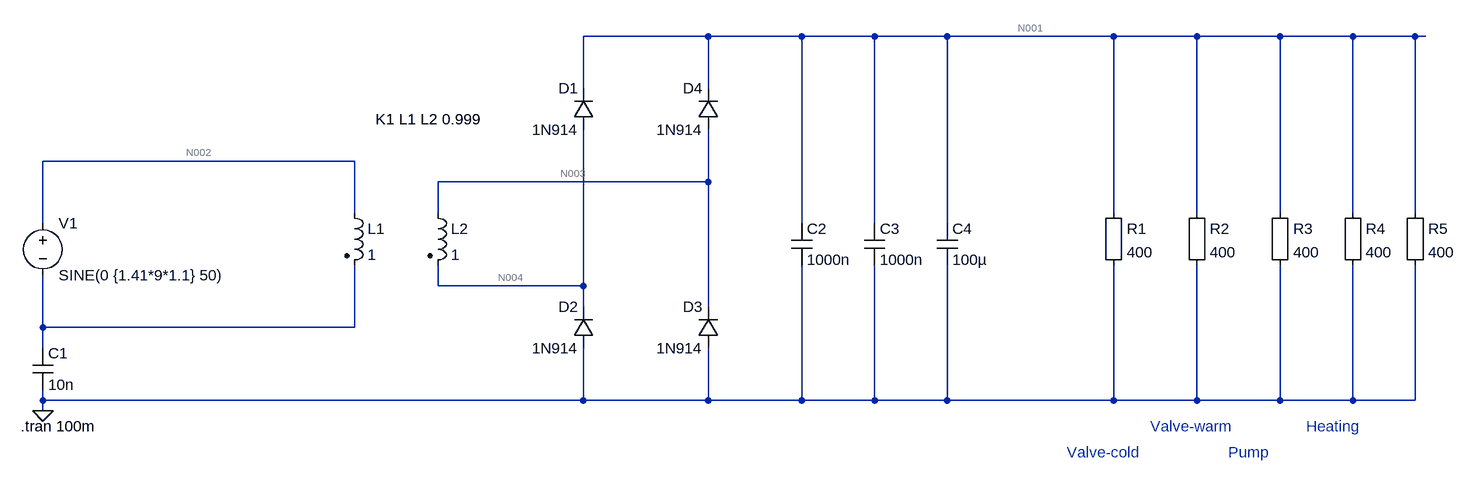
[diagram p0: schematic powersupply.asc]
powersupply.asc, the LTspice schematic file:
Version 4
SHEET 1 2320 680
WIRE 1168 -144 976 -144
WIRE 1312 -144 1168 -144
WIRE 1424 -144 1312 -144
WIRE 1536 -144 1424 -144
WIRE 1792 -144 1536 -144
WIRE 1920 -144 1792 -144
WIRE 2048 -144 1920 -144
WIRE 2160 -144 2048 -144
WIRE 2256 -144 2160 -144
WIRE 2272 -144 2256 -144
WIRE 976 -64 976 -144
WIRE 1168 -64 1168 -144
WIRE 624 48 144 48
WIRE 1168 80 1168 0
WIRE 1168 80 752 80
WIRE 624 128 624 48
WIRE 752 128 752 80
WIRE 1792 128 1792 -144
WIRE 1920 128 1920 -144
WIRE 2048 128 2048 -144
WIRE 2160 128 2160 -144
WIRE 2256 128 2256 -144
WIRE 144 144 144 48
WIRE 1312 144 1312 -144
WIRE 1424 144 1424 -144
WIRE 1536 144 1536 -144
WIRE 752 240 752 208
WIRE 976 240 976 0
WIRE 976 240 752 240
WIRE 976 272 976 240
WIRE 1168 272 1168 80
WIRE 144 304 144 224
WIRE 624 304 624 208
WIRE 624 304 144 304
WIRE 144 336 144 304
WIRE 144 416 144 400
WIRE 976 416 976 336
WIRE 976 416 144 416
WIRE 1168 416 1168 336
WIRE 1168 416 976 416
WIRE 1312 416 1312 208
WIRE 1312 416 1168 416
WIRE 1424 416 1424 208
WIRE 1424 416 1312 416
WIRE 1536 416 1536 208
WIRE 1536 416 1424 416
WIRE 1792 416 1792 208
WIRE 1792 416 1536 416
WIRE 1920 416 1920 208
WIRE 1920 416 1792 416
WIRE 2048 416 2048 208
WIRE 2048 416 1920 416
WIRE 2160 416 2160 208
WIRE 2160 416 2048 416
WIRE 2256 416 2256 208
WIRE 2256 416 2160 416
WIRE 144 432 144 416
FLAG 144 432 0
SYMBOL voltage 144 128 R0
WINDOW 123 0 0 Left 0
WINDOW 39 0 0 Left 0
SYMATTR InstName V1
SYMATTR Value SINE(0 {1.41*9*1.1} 50)
SYMBOL ind2 608 112 R0
SYMATTR InstName L1
SYMATTR Value 1
SYMATTR Type ind
SYMATTR SpiceLine Rser=10m Rpar=1e12
SYMBOL ind2 736 112 R0
SYMATTR InstName L2
SYMATTR Value 1
SYMATTR Type ind
SYMATTR SpiceLine Rser=10m Rpar=1e12
SYMBOL cap 128 336 R0
SYMATTR InstName C1
SYMATTR Value 10n
SYMATTR SpiceLine Rpar=1e12
SYMBOL diode 992 0 R180
WINDOW 0 24 64 Left 2
WINDOW 3 24 0 Left 2
SYMATTR InstName D1
SYMATTR Value 1N914
SYMBOL cap 1296 144 R0
SYMATTR InstName C2
SYMATTR Value 1000n
SYMATTR SpiceLine Rpar=1e12
SYMBOL cap 1408 144 R0
SYMATTR InstName C3
SYMATTR Value 1000n
SYMATTR SpiceLine Rpar=1e12
SYMBOL cap 1520 144 R0
SYMATTR InstName C4
SYMATTR Value 100µ
SYMATTR SpiceLine Rpar=1e12
SYMBOL Misc\\EuropeanResistor 1776 112 R0
SYMATTR InstName R1
SYMATTR Value 400
SYMBOL diode 992 336 R180
WINDOW 0 24 64 Left 2
WINDOW 3 24 0 Left 2
SYMATTR InstName D2
SYMATTR Value 1N914
SYMBOL diode 1184 336 R180
WINDOW 0 24 64 Left 2
WINDOW 3 24 0 Left 2
SYMATTR InstName D3
SYMATTR Value 1N914
SYMBOL diode 1184 0 R180
WINDOW 0 24 64 Left 2
WINDOW 3 24 0 Left 2
SYMATTR InstName D4
SYMATTR Value 1N914
SYMBOL Misc\\EuropeanResistor 1904 112 R0
SYMATTR InstName R2
SYMATTR Value 400
SYMBOL Misc\\EuropeanResistor 2032 112 R0
SYMATTR InstName R3
SYMATTR Value 400
SYMBOL Misc\\EuropeanResistor 2144 112 R0
SYMATTR InstName R4
SYMATTR Value 400
SYMBOL Misc\\EuropeanResistor 2240 112 R0
SYMATTR InstName R5
SYMATTR Value 400
TEXT 656 -16 Left 2 !K1 L1 L2 0.999
TEXT 110 456 Left 2 !.tran 100m
TEXT 1720 496 Left 2 ;Valve-cold
TEXT 1848 456 Left 2 ;Valve-warm
TEXT 1968 496 Left 2 ;Pump
TEXT 2088 456 Left 2 ;Heating

The netlist it stands for:
* powersupply.asc
V1 N002 N005 SINE(0 {1.41*9*1.1} 50)
L1 N002 N005 1 Rser=10m Rpar=1e12
L2 N003 N004 1 Rser=10m Rpar=1e12
C1 N005 0 10n Rpar=1e12
D1 N004 N001 1N914
C2 N001 0 1000n Rpar=1e12
C3 N001 0 1000n Rpar=1e12
C4 N001 0 100µ Rpar=1e12
R1 N001 0 400
D2 0 N004 1N914
D3 0 N003 1N914
D4 N003 N001 1N914
R2 N001 0 400
R3 N001 0 400
R4 N001 0 400
R5 N001 0 400
.model D D
.lib standard.dio
K1 L1 L2 0.999
.tran 100m
* Valve-cold
* Valve-warm
* Pump
* Heating
.backanno
.end

* Results of the author's LTspice run, read from the files saved beside the schematic
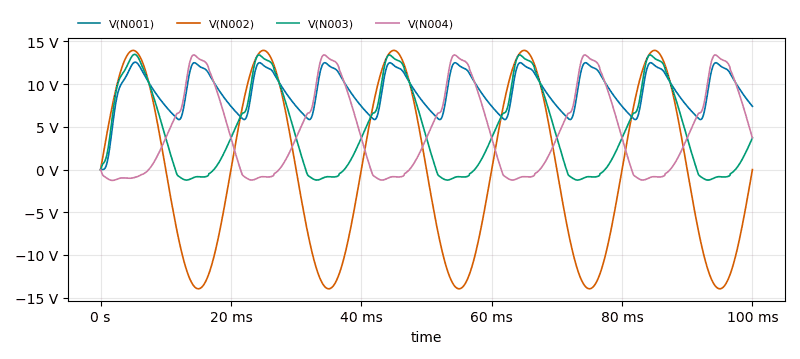
[diagram p1: Transient Analysis of powersupply.asc, plotted from the saved traces]
* Transient Analysis, 1 run:
*   V(N001): min 0 V, max 12.58 V, average 9.211 V, rms 9.53 V, last 7.413 V
*   V(N002): min -13.96 V, max 13.96 V, average 19.35 µV, rms 9.873 V, last 0 V
*   V(N003): min -1.225 V, max 13.49 V, average 4.605 V, rms 6.873 V, last 3.709 V
*   V(N004): min -1.268 V, max 13.42 V, average 4.606 V, rms 6.882 V, last 3.704 V